# Altium schematic sheet 01.mian.SchDoc
size A4; Author: 刘时杰; CompanyName: 广州致远电子有限公司; DocumentNumber: 1; SheetNumber: 1; SheetTotal: 8; PageSetup: Record=PageOptions|CenterHorizontal=True|CenterVertical=True|PrintScale=1.00|XCorrection=1.00|YCorrection=1.00|PrintKind=0|BorderSize=5000000|LeftOffset=0|BottomOffset=0|Orientation=2|PaperLength=1000|PaperWidth=1000|Scale=100|PaperSource=7|PrintQuality=600|MediaType=1|DitherType=10|PaperKind=A4|PrintScaleMode=1; DesignDate: 20180913; CheckDate: 20180913; SheetName: mian; SheetVersion: V1.00; SheetDescription: AML166 评估板; ProductName: AML166-Core; ProductModel: AML166
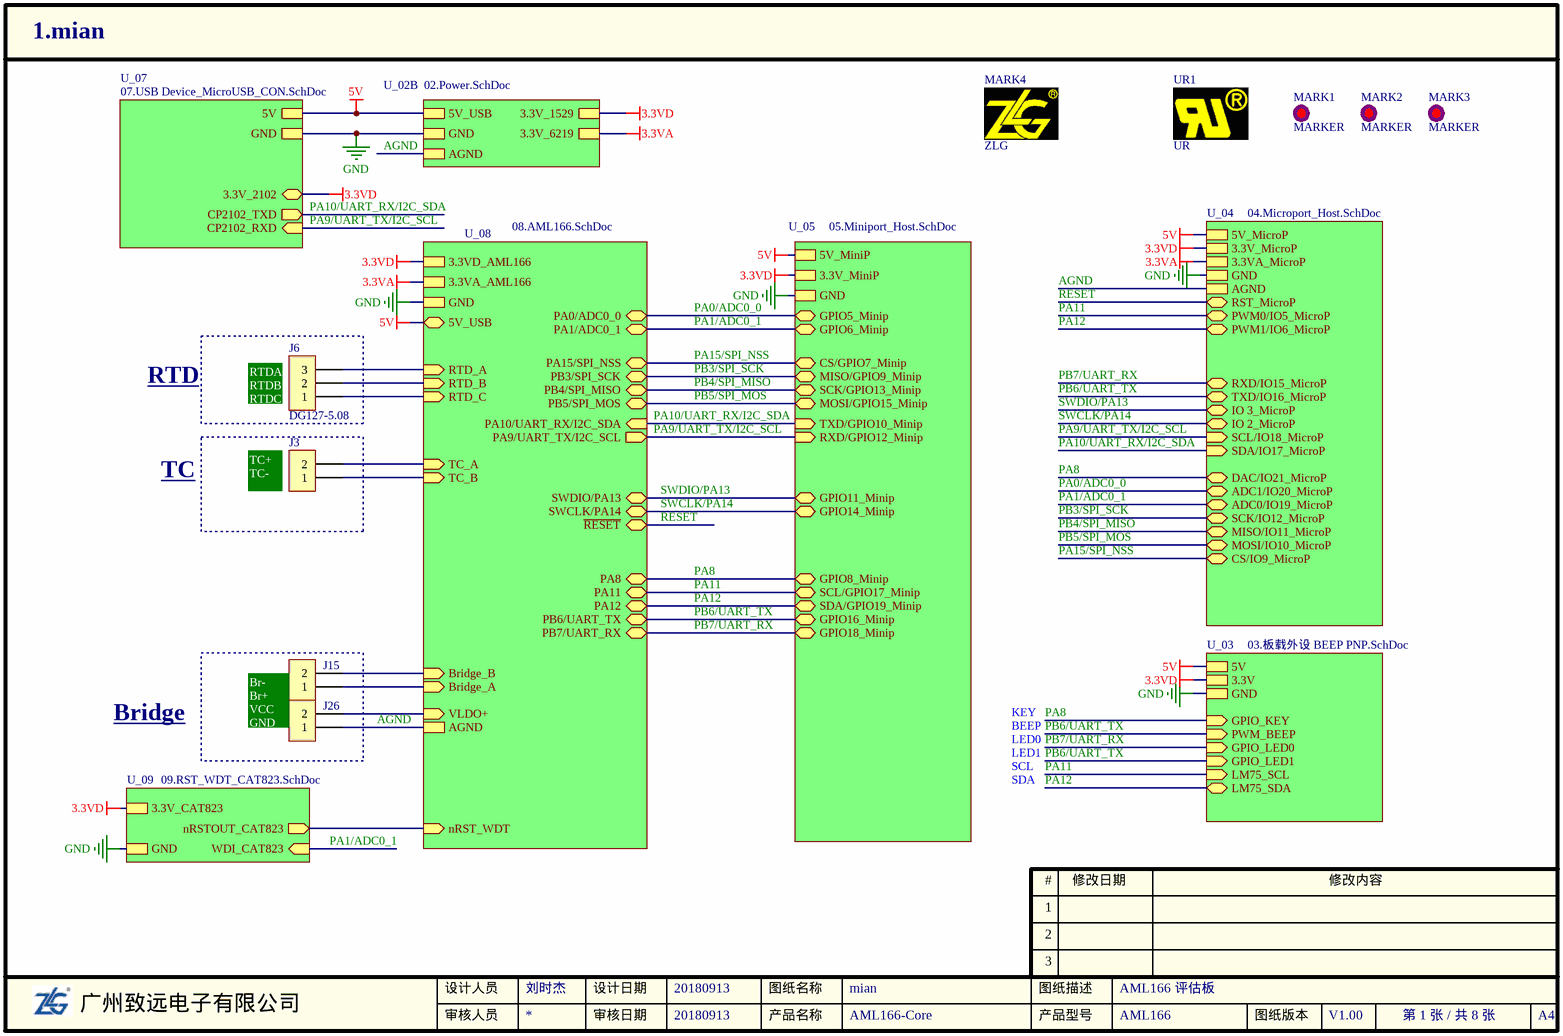
[diagram p0: 01.mian.SchDoc]

## Parts
J3  (no value)  [CON508P810W130D15S-2DIP]
J6  DG127-5.08  [CON508P1524L810W110D15S-3DIP]
J15  (no value)  [CON508P810W130D15S-2DIP]
J26  (no value)  [CON508P810W130D15S-2DIP]
MARK1  MARKER  [MARKER-C-1.0M]  (no BOM)
MARK2  MARKER  [MARKER-C-1.0M]  (no BOM)
MARK3  MARKER  [MARKER-C-1.0M]  (no BOM)
MARK4  ZLG  [ZLG0.7]  (no BOM)
UR1  UR  [ZY_UR-3X2]  (no BOM)

## Sub-sheets
U_02B = 02.Power.SchDoc: GND, 5V_USB, 3.3V_1529, 3.3V_6219, AGND
U_03 = 03.板载外设 BEEP PNP.SchDoc: GND, 3.3V, PWM_BEEP (in), GPIO_LED0 (in), GPIO_LED1 (in), 5V, LM75_SCL (in), LM75_SDA (bidir), GPIO_KEY (in)
U_04 = 04.Microport_Host.SchDoc: GND, 3.3V_MicroP, AGND, 5V_MicroP, 3.3VA_MicroP, RXD/IO15_MicroP (bidir), TXD/IO16_MicroP (bidir), MOSI/IO10_MicroP (bidir), SCK/IO12_MicroP (bidir), MISO/IO11_MicroP (bidir), IO 3_MicroP (bidir), IO 2_MicroP (bidir), PWM1/IO6_MicroP (bidir), PWM0/IO5_MicroP (bidir), SDA/IO17_MicroP (in), SCL/IO18_MicroP (in), ADC1/IO20_MicroP (bidir), ADC0/IO19_MicroP (bidir), DAC/IO21_MicroP (bidir), RST_MicroP (bidir), CS/IO9_MicroP (bidir)
U_05 = 05.Miniport_Host.SchDoc: GND, 3.3V_MiniP, 5V_MiniP, MISO/GPIO9_Minip (bidir), GPIO5_Minip (bidir), MOSI/GPIO15_Minip (bidir), SCK/GPIO13_Minip (bidir), GPIO11_Minip (bidir), CS/GPIO7_Minip (bidir), GPIO14_Minip (bidir), GPIO6_Minip (bidir), RXD/GPIO12_Minip (in), TXD/GPIO10_Minip (in), GPIO8_Minip (bidir), GPIO16_Minip (bidir), SDA/GPIO19_Minip (bidir), SCL/GPIO17_Minip (bidir), GPIO18_Minip (bidir)
U_07 = 07.USB Device_MicroUSB_CON.SchDoc: 5V, GND, CP2102_TXD (out), CP2102_RXD (in), 3.3V_2102
U_08 = 08.AML166.SchDoc: nRST_WDT (in), 3.3VD_AML166, PA10/UART_RX/I2C_SDA (in), PA15/SPI_NSS (bidir), PA0/ADC0_0 (bidir), PA1/ADC0_1 (bidir), PA9/UART_TX/I2C_SCL (out), PB3/SPI_SCK (bidir), PB5/SPI_MOS (bidir), PA11 (bidir), PA12 (bidir), PB7/UART_RX (bidir), PB4/SPI_MISO (bidir), PA8 (bidir), PB6/UART_TX (bidir), GND, RTD_A (in), RTD_B (in), RTD_C (in), TC_A (in), TC_B (in), AGND, SWDIO/PA13 (bidir), SWCLK/PA14 (bidir), ~{RESET} (bidir), 3.3VA_AML166, Bridge_A (in), Bridge_B (in), VLDO+ (in), 5V_USB
U_09 = 09.RST_WDT_CAT823.SchDoc: GND, 3.3V_CAT823, WDI_CAT823 (in), nRSTOUT_CAT823 (out)

## Nets
3.3VA: sheet U_08/3.3VA_AML166, sheet U_04/3.3VA_MicroP, sheet U_02B/3.3V_6219
3.3VD: sheet U_08/3.3VD_AML166, sheet U_05/3.3V_MiniP, sheet U_04/3.3V_MicroP, sheet U_03/3.3V, sheet U_02B/3.3V_1529, sheet U_09/3.3V_CAT823, sheet U_07/3.3V_2102
5V: sheet U_08/5V_USB, sheet U_05/5V_MiniP, sheet U_04/5V_MicroP, sheet U_03/5V, sheet U_02B/5V_USB, sheet U_07/5V
GND: sheet U_08/GND, sheet U_05/GND, sheet U_04/GND, sheet U_03/GND, sheet U_02B/GND, sheet U_09/GND, sheet U_07/GND
AGND: J26.1 ; sheet U_08/AGND, sheet U_04/AGND, sheet U_02B/AGND
PA0/ADC0_0: sheet U_08/PA0/ADC0_0, sheet U_05/GPIO5_Minip, sheet U_04/ADC1/IO20_MicroP
PA1/ADC0_1: sheet U_08/PA1/ADC0_1, sheet U_05/GPIO6_Minip, sheet U_04/ADC0/IO19_MicroP, sheet U_09/WDI_CAT823
PA8: sheet U_08/PA8, sheet U_05/GPIO8_Minip, sheet U_04/DAC/IO21_MicroP, sheet U_03/GPIO_KEY
PA9/UART_TX/I2C_SCL: sheet U_08/PA9/UART_TX/I2C_SCL, sheet U_05/RXD/GPIO12_Minip, sheet U_04/SCL/IO18_MicroP, sheet U_07/CP2102_RXD
PA10/UART_RX/I2C_SDA: sheet U_08/PA10/UART_RX/I2C_SDA, sheet U_05/TXD/GPIO10_Minip, sheet U_04/SDA/IO17_MicroP, sheet U_07/CP2102_TXD
PA11: sheet U_08/PA11, sheet U_05/SCL/GPIO17_Minip, sheet U_04/PWM0/IO5_MicroP, sheet U_03/LM75_SCL
PA12: sheet U_08/PA12, sheet U_05/SDA/GPIO19_Minip, sheet U_04/PWM1/IO6_MicroP, sheet U_03/LM75_SDA
PA15/SPI_NSS: sheet U_08/PA15/SPI_NSS, sheet U_05/CS/GPIO7_Minip, sheet U_04/CS/IO9_MicroP
PB3/SPI_SCK: sheet U_08/PB3/SPI_SCK, sheet U_05/MISO/GPIO9_Minip, sheet U_04/SCK/IO12_MicroP
PB4/SPI_MISO: sheet U_08/PB4/SPI_MISO, sheet U_05/SCK/GPIO13_Minip, sheet U_04/MISO/IO11_MicroP
PB5/SPI_MOS: sheet U_08/PB5/SPI_MOS, sheet U_05/MOSI/GPIO15_Minip, sheet U_04/MOSI/IO10_MicroP
PB6/UART_TX: sheet U_08/PB6/UART_TX, sheet U_05/GPIO16_Minip, sheet U_04/TXD/IO16_MicroP, sheet U_03/PWM_BEEP, sheet U_03/GPIO_LED1
PB7/UART_RX: sheet U_08/PB7/UART_RX, sheet U_05/GPIO18_Minip, sheet U_04/RXD/IO15_MicroP, sheet U_03/GPIO_LED0
~{RESET}: sheet U_08/~{RESET}, sheet U_04/RST_MicroP
SWCLK/PA14: sheet U_08/SWCLK/PA14, sheet U_05/GPIO14_Minip, sheet U_04/IO 2_MicroP
SWDIO/PA13: sheet U_08/SWDIO/PA13, sheet U_05/GPIO11_Minip, sheet U_04/IO 3_MicroP
NetJ3_1: J3.1 ; sheet U_08/TC_B
NetJ3_2: J3.2 ; sheet U_08/TC_A
NetJ6_1: J6.1 ; sheet U_08/RTD_C
NetJ6_2: J6.2 ; sheet U_08/RTD_B
NetJ6_3: J6.3 ; sheet U_08/RTD_A
NetJ15_1: J15.1 ; sheet U_08/Bridge_A
NetJ15_2: J15.2 ; sheet U_08/Bridge_B
NetJ26_2: J26.2 ; sheet U_08/VLDO+
(unnamed): sheet U_08/nRST_WDT, sheet U_09/nRSTOUT_CAT823

Not connected (* = marked no-connect by the designer): MARK1 0; MARK2 0; MARK3 0

## Notes on the sheet
- RTD
- (near J6) RTDA
  RTDB
  RTDC
- TC
- (near J3) TC+
  TC-
- KEY
- Bridge
- Br-
  Br+
  VCC
  GND
- BEEP
- LED0
- LED1
- SCL
- SDA
- 1
- #
- 修改日期
- 修改内容
- 2
- 3
- 设计人员
- 审核人员
- 设计日期
- 审核日期
- 产品名称
- 图纸名称
- 产品型号
- 图纸描述
- 图纸版本
- A4

## Library data of the parts
J3 J15 J26 = 1.10.06.0070: DG127-5.08-02P-14-00AH,180°,绿色,DEGSON,RoHS; 名称: 端子; 贴片和直插: THT; PCB备注: xhm-lq-wyy-150126; 器件优选方案: 正常状态，可以选用; 物料代码: 1.10.06.0070; 厂商: DEGSON; RoHS: RoHS; 型号: DG127-5.08-02P-14-00AH,180°,绿色; ComponentLink1Description: ErpDataInfo; ComponentLink1URL: http://erp.zlgmcu.com/ErpExt/ErpData/ListMateriel.aspx?pkey=1.10.06.0070
J6 = 19.04.00251: DG127-5.08-03P-14-00AH,180°,绿色,THT; 名称: 端子; PCB备注: 180925 yyf; 物料代码: 19.04.00251; Value: DG127-5.08; 型号: DG127-5.08-03P-14-00AH,180°,绿色,THT; 贴片和直插: THT; ComponentLink1Description: ErpDataInfo